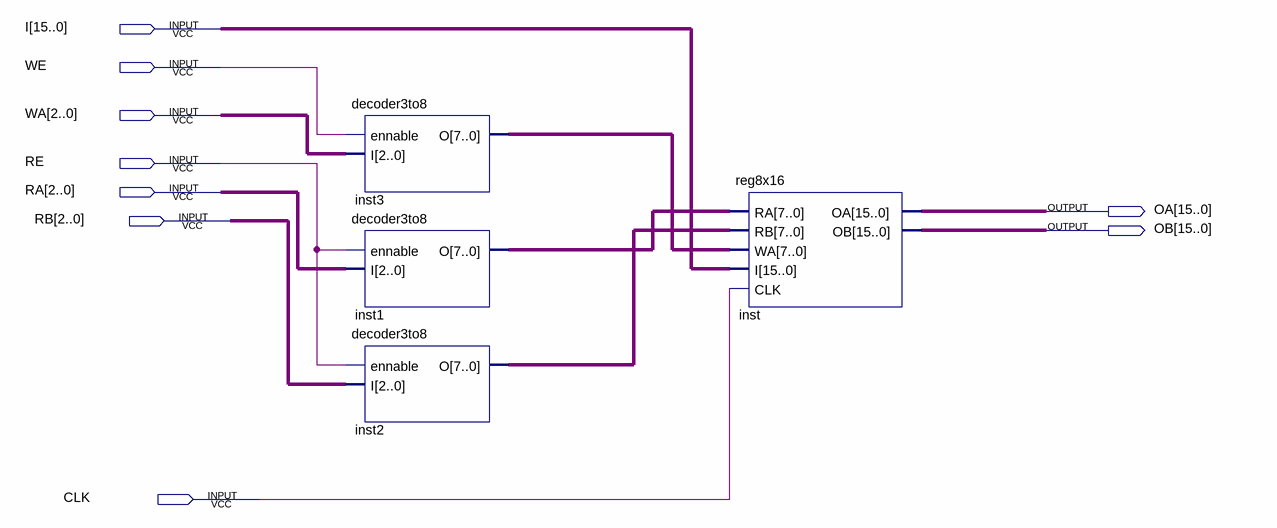
[diagram p0: schematic sheet]
// Quartus schematic RF8x16.bdf as structural Verilog: 4 symbols, 9 pins
module RF8x16 (
  input  [15:0] I,
  input  WE,
  input  [2:0] WA,
  input  RE,
  input  [2:0] RA,
  input  [2:0] RB,
  input  CLK,
  output [15:0] OA,
  output [15:0] OB
);

  wire [7:0] inst1_o, inst2_o, inst3_o;

  decoder3to8 inst3 (.ennable(WE), .I(WA), .O(inst3_o));
  decoder3to8 inst1 (.ennable(RE), .I(RA), .O(inst1_o));
  decoder3to8 inst2 (.ennable(RE), .I(RB), .O(inst2_o));
  reg8x16 inst (.RA(inst1_o), .RB(inst2_o), .WA(inst3_o), .I(I), .CLK(CLK), .OA(OA), .OB(OB));
endmodule
